# EAGLE design Air Pressure Sensor Breakout (EAGLE 5.12)
PARTNO: MPXA4250AC6U/C6T1
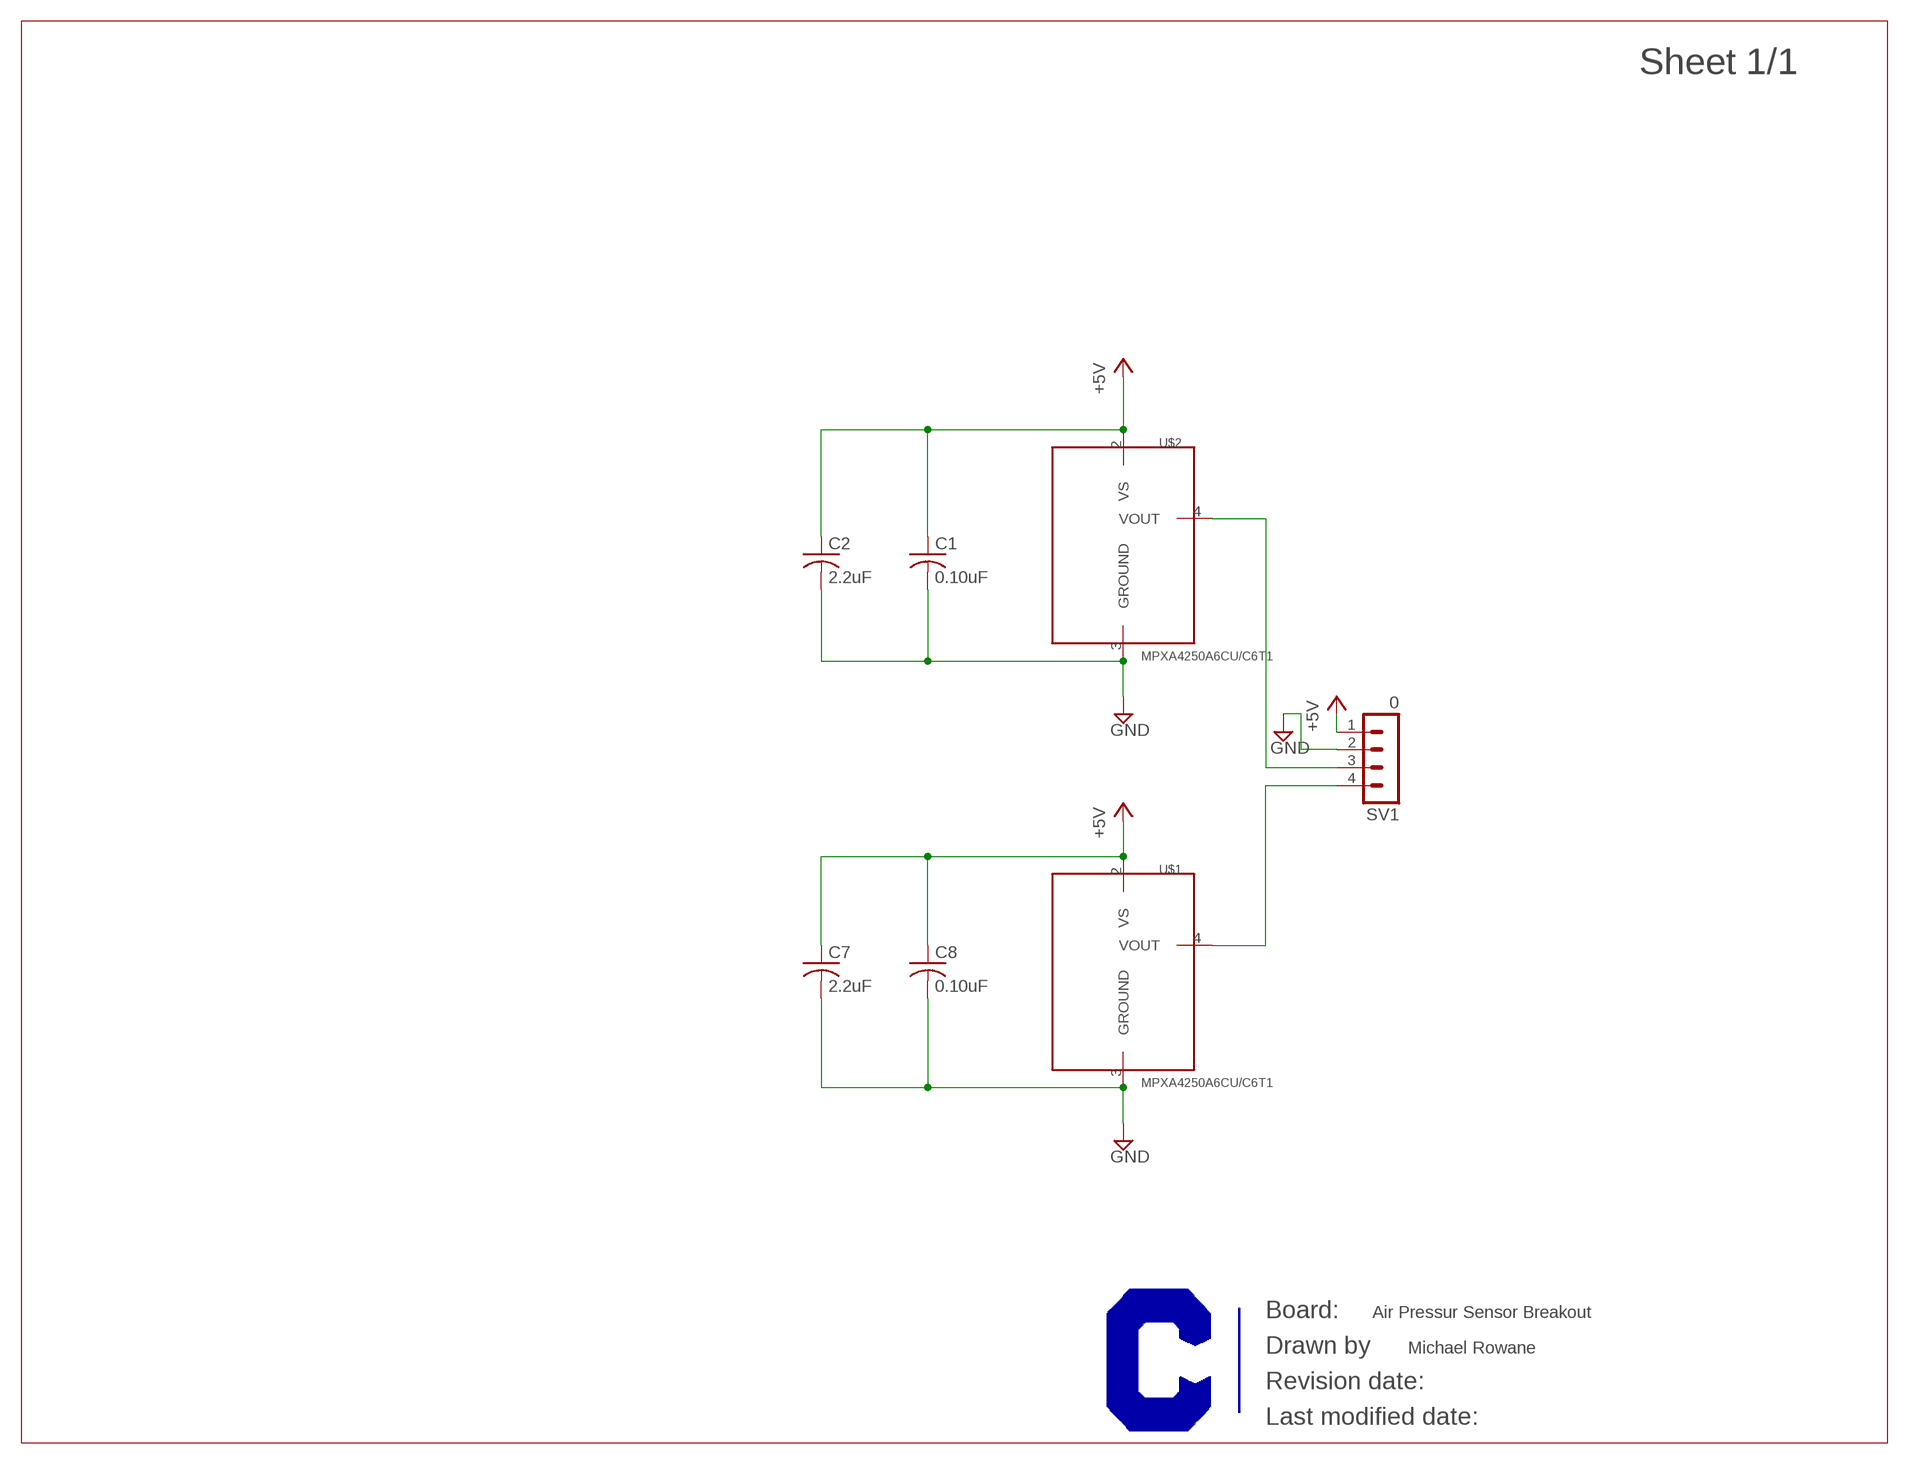
[diagram p0: schematic, sheet 1]

## Parts
C1  0.10uF  C-USC0603  [C0603]
C2  2.2uF  C-USC0603  [C0603]
C7  2.2uF  C-USC0603  [C0603]
C8  0.10uF  C-USC0603  [C0603]
SV1  0  MA04-1  [MA04-1]
U$1  MPXA4250A6CU/C6T1  [MPXA4250AC6U/C6T1]
U$2  MPXA4250A6CU/C6T1  [MPXA4250AC6U/C6T1]
U$3  CURRENT-C-LETTER-LANDSCAPE  [BLANK]

## Nets
+5V: C1.1 C2.1 C7.1 C8.1 SV1.1 U$1.2(VS) U$2.2(VS)
GND: C1.2 C2.2 C7.2 C8.2 SV1.2 U$1.3(GROUND) U$2.3(GROUND)
N$8: SV1.3 U$2.4(VOUT)
N$9: SV1.4 U$1.4(VOUT)

## Notes on the sheet
- Air Pressur Sensor Breakout
- Michael Rowane

## Library data of the parts
C1 C2 C7 C8 = rcl:C-US: CAPACITOR, American symbol
SV1 = con-lstb:MA04-1: PIN HEADER; OC_FARNELL: unknown; OC_NEWARK: unknown
U$1 U$2 = Freescale:MPXA4250A6CU/C6T1: Datasheet: http://cache.freescale.com/files/sensors/doc/data_sheet/MPX4250A.pdf M.R. 2-15-15; PARTNO: MPXA4250A6CU/C6T1
U$3 = Frames:CURRENT-C-LETTER-LANDSCAPE; BOM: EXCLUDE

## Board
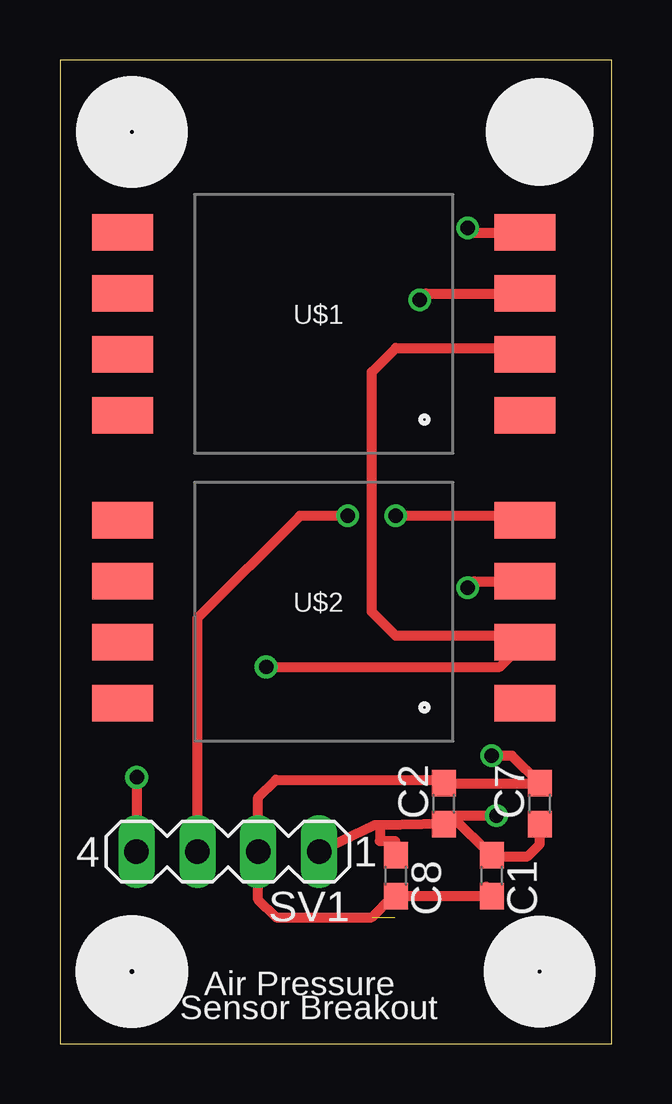
[diagram p1: board, top side]
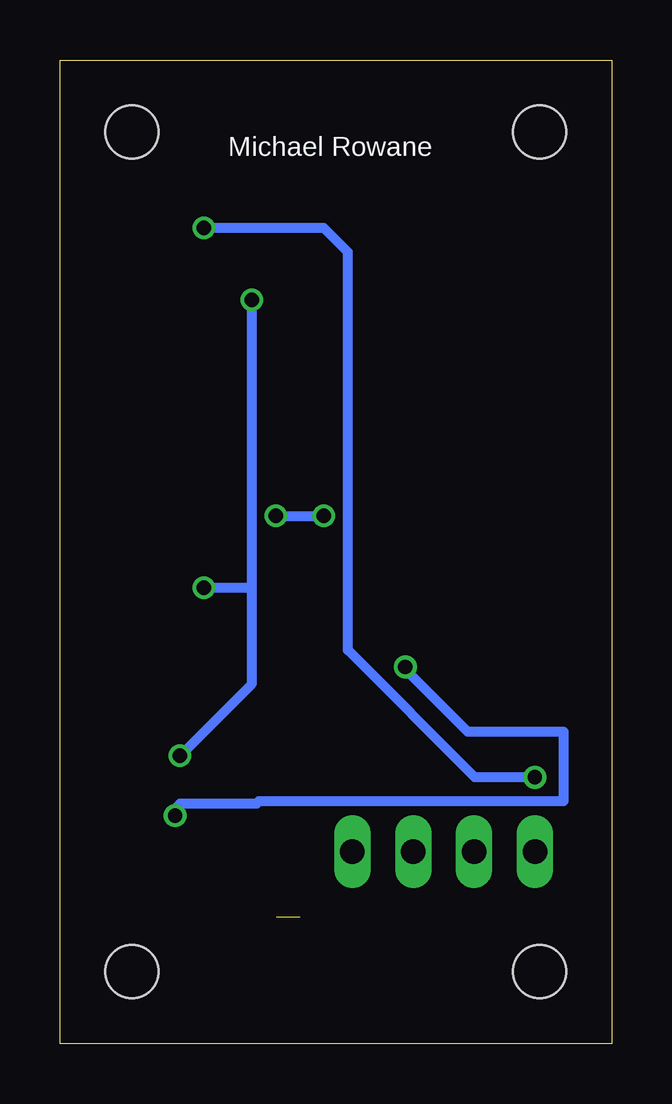
[diagram p2: board, bottom side, seen from below]

Size 23 x 41 mm. Coordinates in mm from the lower left corner, seen from the top.
Outline: 0,0 23,0 23,41 0,41 0,0
Copper layers (1*16): Top 0.0356mm / dielectric 1.5011mm / Bottom 0.0356mm
Design rules "OSH Park 2-layer": minimum track width 6mil, minimum drill 13mil, track to track 6mil, track to pad 6mil, pad to pad 6mil, via to via 6mil, smd to smd 6mil, copper to edge 15mil, drill to drill 6mil, minimum pad ring 7mil, minimum via ring 7mil, stop-mask expansion 4mil, vias tented up to drill 0mil, thermal gap 10mil
Holes 2.2 mm at 3,38 20,38 3,3 20,3

### Footprints (pad centres in the part's own frame; a part is rotated, then mirrored left to right if it is on the bottom)
C0603 = smd 1.1 x 1: 1 -0.85,0; 2 0.85,0
MA04-1 = drill 1.016 long: 1 -3.81,0; 2 -1.27,0; 3 1.27,0; 4 3.81,0
MPXA4250AC6U/C6T1 = smd 2.54 x 1.52: 1 8.38,-3.81; 2 8.38,-1.27; 3 8.38,1.27; 4 8.38,3.81; 5 -8.38,3.81; 6 -8.38,1.27; 7 -8.38,-1.27; 8 -8.38,-3.81

### Placement (x,y rotation side)
C1  18,7 270 top
C2  16,10 90 top
C7  20,10 90 top
C8  14,7 270 top
SV1  7,8 180 top
U$1  11,30 0 top
U$2  11,18 0 top
U$3  -19.05,37.02 0 top  (outside the outline)

### Tracks (layer width: path | path; a pad name or v marks a point on that pad's centre or on a via)
+5V  (via drill 0.6)
  Top 0.406: 13.34,9.1 C2.1 16.3,9.5 | SV1.1 13.12,9.1 13.34,9.1 | 16.3,9.5 C1.1 17.78,7.81 19.5,7.81 20,8.31 C7.1 | 13.34,9.1 13.34,8.45 13.97,8.45 C8.1 | U$1.2 19.11,29 14,29 13,28 13,18 14,17 19.11,17 U$2.2 18.35,15.7 v8.6,15.7 | v18.2,9.5 16.3,9.5
  Bottom 0.406: v18.2,9.5 18.2,9.8 18,10 14.8,10 14.7,10.1 2,10.1 2,13 6,13 8.6,15.6 v8.6,15.7
GND  (via drill 0.6)  (1 unrouted)
  Top 0.406: 17.78,6.54 C1.2 C8.2 13.88,6.15 13,5.27 9,5.27 8.27,6 SV1.2 8.27,10.27 9,11 15.85,11 C2.2 C7.2 18.85,12 v18,12 | U$1.3 15.27,31.27 v15,31 | U$2.3 17.27,19.27 v17,19
  Bottom 0.406: 15,19 15,15 v18,12 | 15,19 v15,31 | 15,19 v17,19
N$8  (via drill 0.6)
  Top 0.406: U$2.4 19.19,22 v14,22 | SV1.3 5.73,17.73 10,22 v12,22
  Bottom 0.406: v14,22 v12,22
N$9  (via drill 0.6)
  Top 0.406: U$1.4 17.19,33.81 v17,34 | v3.2,11.1 SV1.4
  Bottom 0.406: v17,34 12,34 11,33 11,16.4 5.7,11.1 v3.2,11.1

### Text on the board
tPlace: Air Pressure | Sensor Breakout
bPlace: Michael Rowane